# EasyEDA schematic Sheet_1.json
TITLE: Sheet_1; REV: 1.0; Date: 2022-01-08; Sheet: 1/1; Drawn By: jackedward.nolan; Company: Your Company
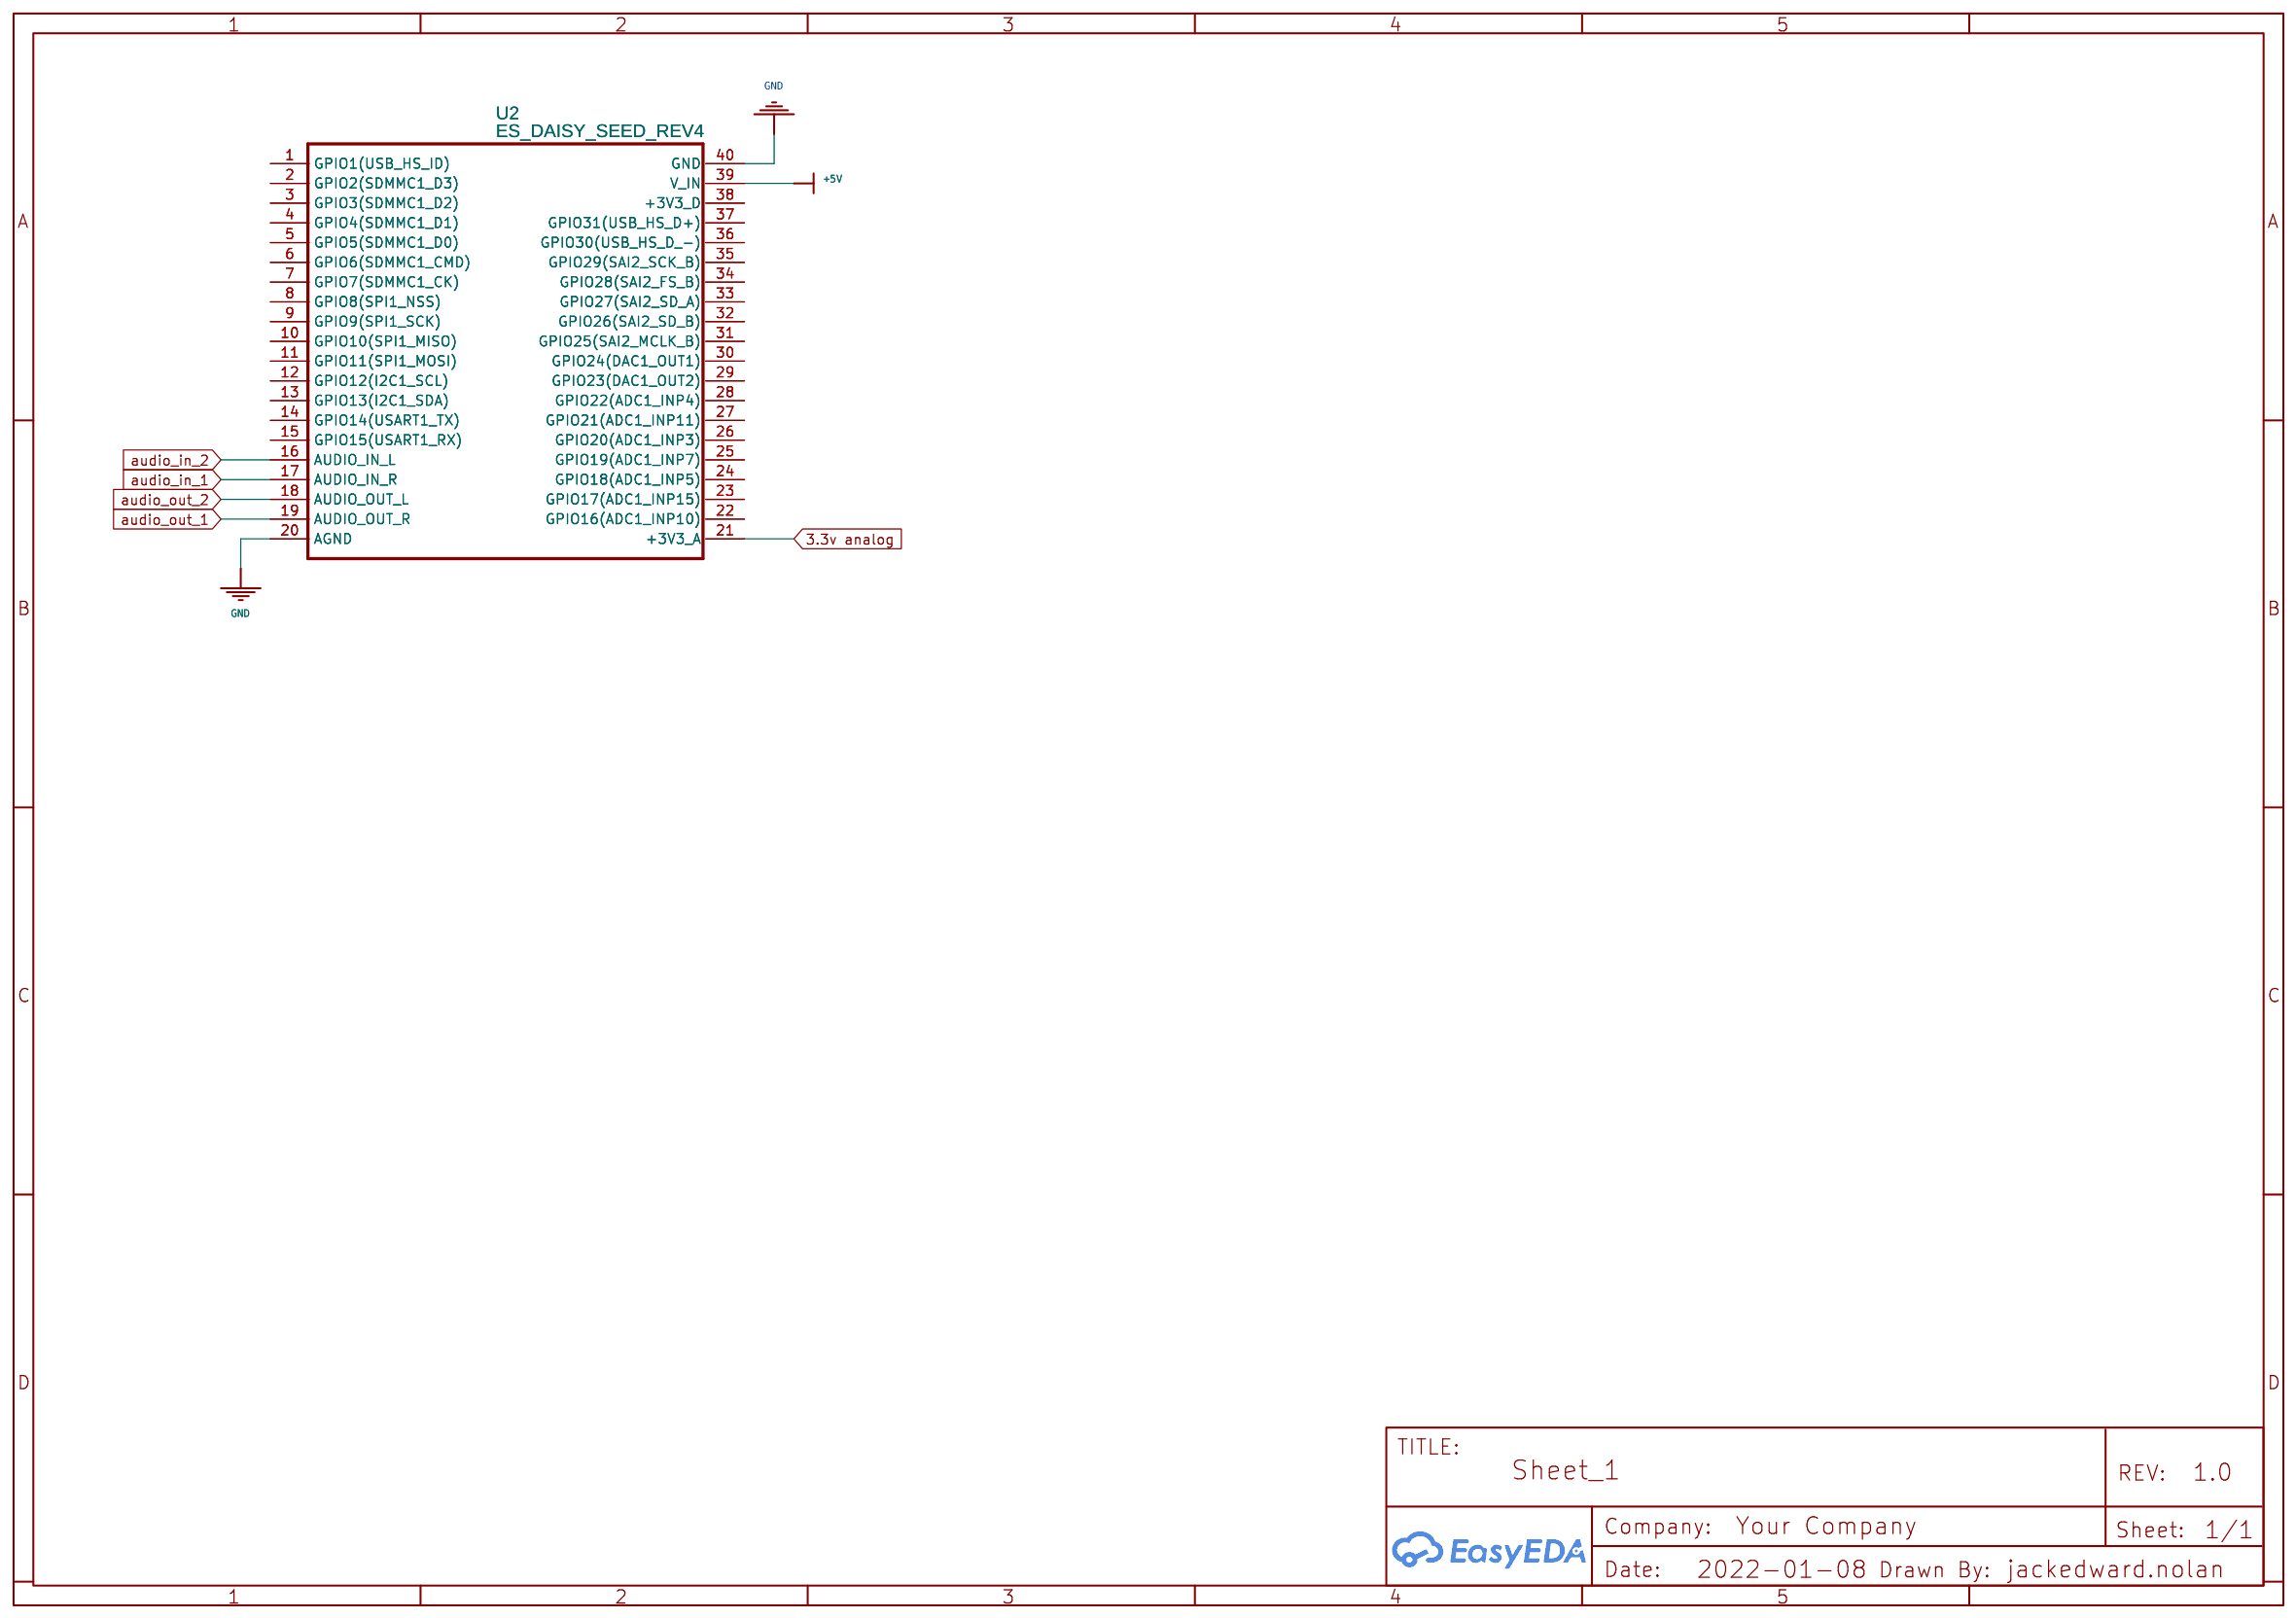
[diagram p0: schematic sheet]

## Parts
U2  ES_DAISY_SEED_REV4  [ES_DAISY_SEED]

## Library data of the parts
U2 = ES_DAISY_SEED_REV4: Contributor: prvlnrzrlv

## Nets
3.3v analog: U2.21(+3V3_A)
+5V: U2.39(V_IN)
GND: U2.20(AGND) U2.40(GND)
audio_in_1: U2.17(AUDIO_IN_R)
audio_in_2: U2.16(AUDIO_IN_L)
audio_out_1: U2.19(AUDIO_OUT_R)
audio_out_2: U2.18(AUDIO_OUT_L)

Not connected (* = marked no-connect by the designer): U2 1(GPIO1(USB_HS_ID)) 2(GPIO2(SDMMC1_D3)) 3(GPIO3(SDMMC1_D2)) 4(GPIO4(SDMMC1_D1)) 5(GPIO5(SDMMC1_D0)) 6(GPIO6(SDMMC1_CMD)) 7(GPIO7(SDMMC1_CK)) 8(GPIO8(SPI1_NSS)) 9(GPIO9(SPI1_SCK)) 10(GPIO10(SPI1_MISO)) 11(GPIO11(SPI1_MOSI)) 12(GPIO12(I2C1_SCL)) 13(GPIO13(I2C1_SDA)) 14(GPIO14(USART1_TX)) 15(GPIO15(USART1_RX)) 22(GPIO16(ADC1_INP10)) 23(GPIO17(ADC1_INP15)) 24(GPIO18(ADC1_INP5)) 25(GPIO19(ADC1_INP7)) 26(GPIO20(ADC1_INP3)) 27(GPIO21(ADC1_INP11)) 28(GPIO22(ADC1_INP4)) 29(GPIO23(DAC1_OUT2)) 30(GPIO24(DAC1_OUT1)) 31(GPIO25(SAI2_MCLK_B)) 32(GPIO26(SAI2_SD_B)) 33(GPIO27(SAI2_SD_A)) 34(GPIO28(SAI2_FS_B)) 35(GPIO29(SAI2_SCK_B)) 36(GPIO30(USB_HS_D_-)) 37(GPIO31(USB_HS_D+)) 38(+3V3_D)
